# Altium schematic sheet FRC0402F47R0TS.schdoc
size 127 x 101 mm
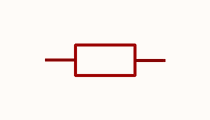
[diagram p0: FRC0402F47R0TS.schdoc]

## Parts
R?  frc0402f47r0ts  [R0402]  (value not drawn)

## Nets

Not connected (* = marked no-connect by the designer): R? 1 2

## Library data of the parts
R? = frc0402f47r0ts: 电阻类型:厚膜电阻;阻值:47Ω;精度:±1%;功率:62.5mW;工作电压:50V;温度系数:±100ppm/℃;; Manufacturer: FOJAN(富捷); AddInBom: yes; ModelId: 98c88bc2b9094f218f3a3e30a7012738; ModelName: R0402_L1.0-W0.5-H0.4; ModelTransform: 39.37,19.685,0,0,0,0,0,0,0; Value: 47Ω; Tolerance: ±1%; Power(Watts): 62.5mW; Voltage-Supply(Max): 50V; Symbol: FRC0402F47R0TS; LCSC Part Name: 47Ω ±1% 62.5mW 厚膜电阻; SupplierPart: C2909362; ManufacturerPart: FRC0402F47R0TS; Supplier Footprint: 0402; JLCPCB Part Class: Extended Part; Datasheet: https://item.szlcsc.com/datasheet/FRC0402F47R0TS/3186297.html; Supplier: LCSC; ConvertToPcb: yes; FootprintName: R0402; Type: 厚膜电阻; Temperature Coefficient: ±100ppm/℃; Operating Temperature: -55℃~+155℃